# Altium schematic sheet DMB.SchDoc
size B
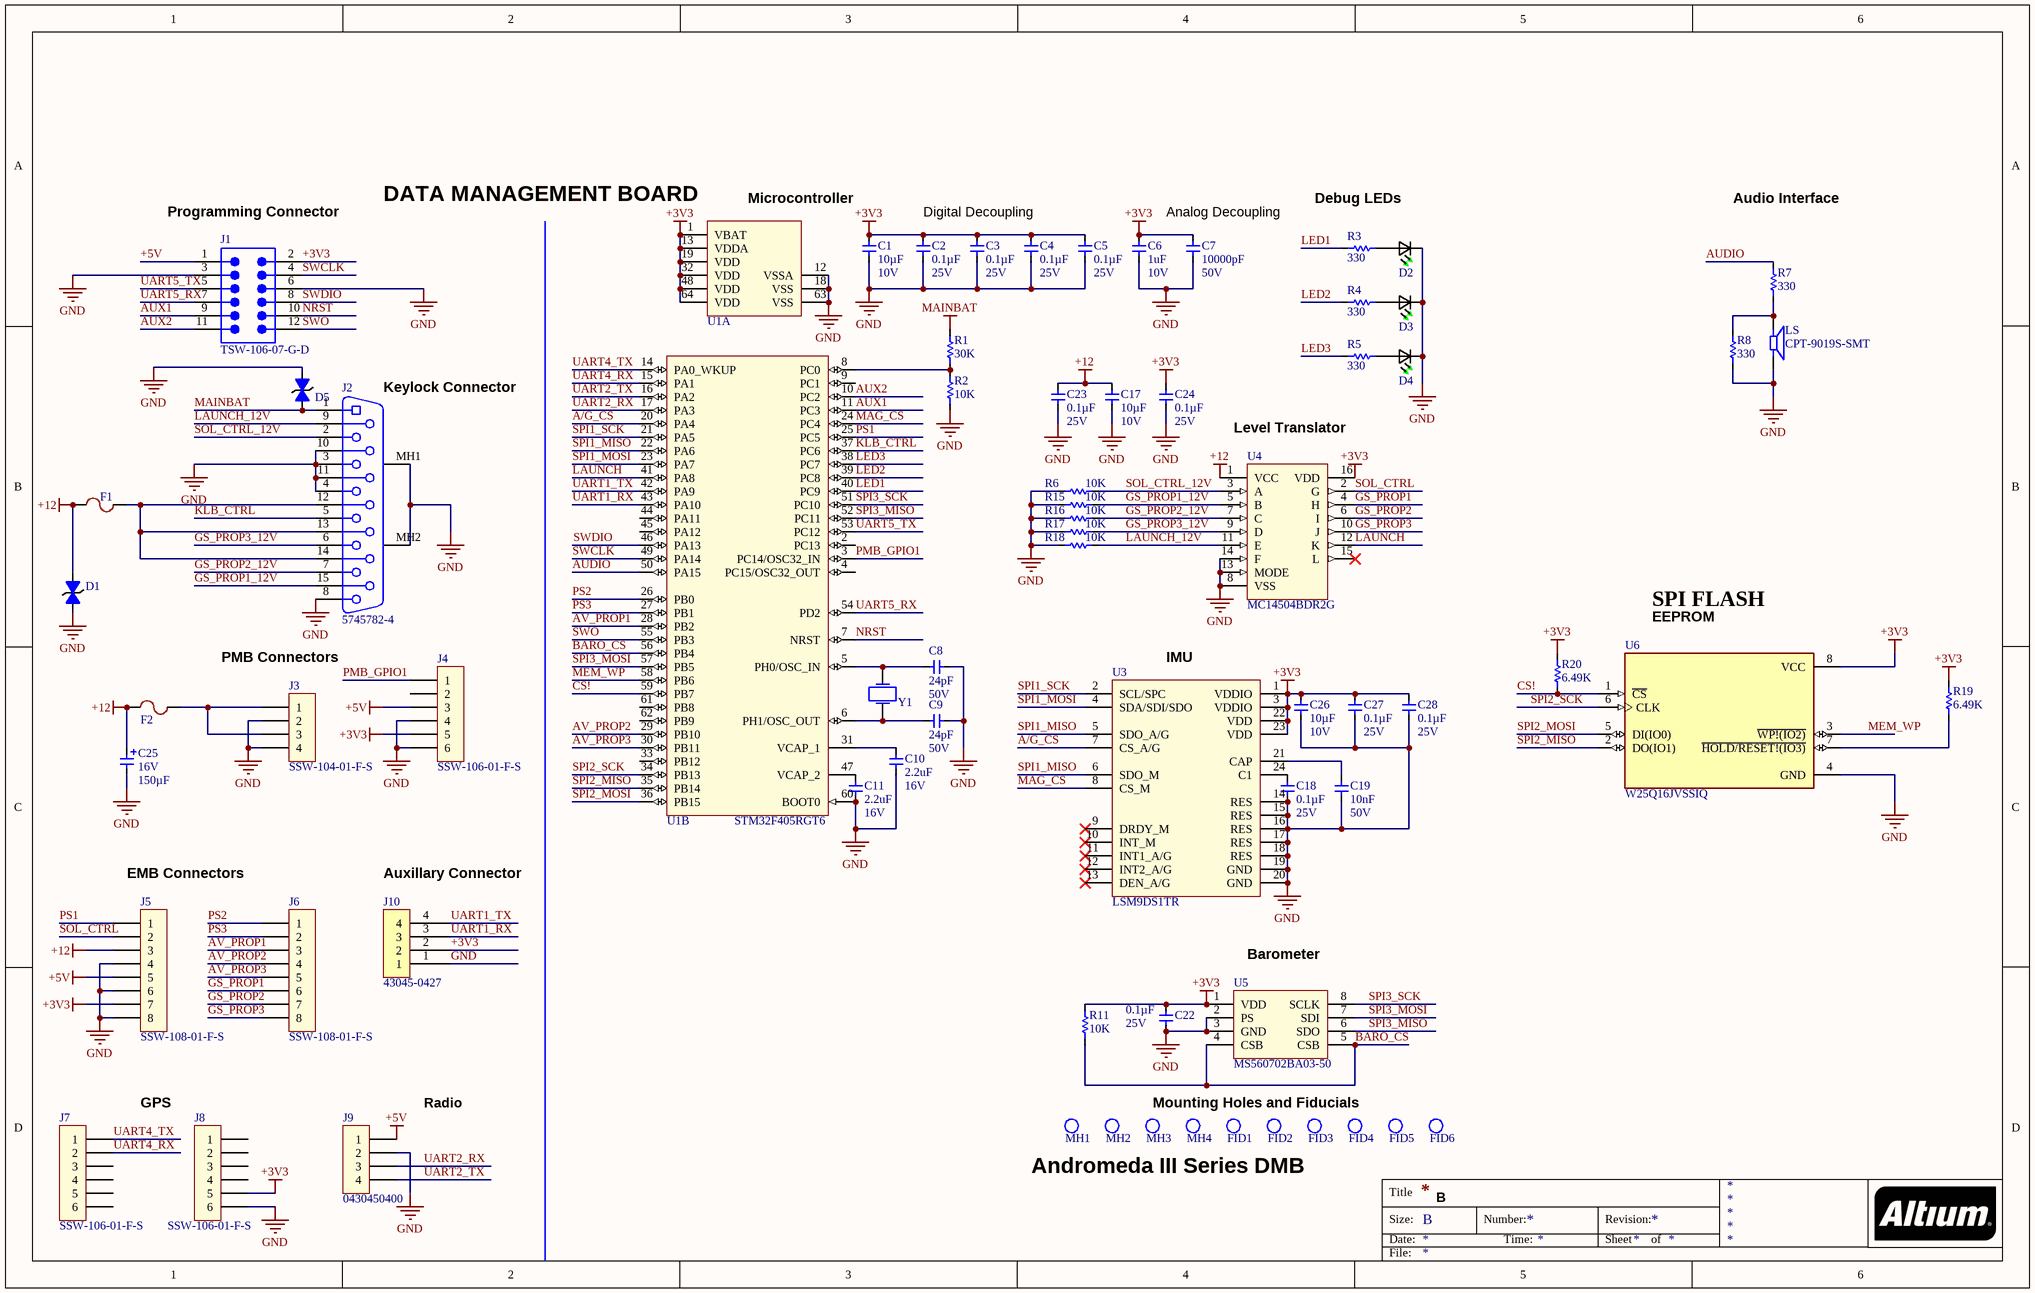
[diagram p0: DMB.SchDoc]

## Parts
C1  Capacitance: 10µF  Voltage - Rated: 10V  [0603[1608]]  (hidden comment: CL10A106MP8NNNC)
C2  Capacitance: 0.1µF  Voltage - Rated: 25V  [0603[1608]]  (hidden comment: CGA3E2X7R1E104K080AA)
C3  Capacitance: 0.1µF  Voltage - Rated: 25V  [0603[1608]]  (hidden comment: CGA3E2X7R1E104K080AA)
C4  Capacitance: 0.1µF  Voltage - Rated: 25V  [0603[1608]]  (hidden comment: CGA3E2X7R1E104K080AA)
C5  Capacitance: 0.1µF  Voltage - Rated: 25V  [0603[1608]]  (hidden comment: CGA3E2X7R1E104K080AA)
C6  Capacitance: 1uF  Voltage - Rated: 10V  [0603[1608]]  (hidden comment: CL10A105KP8NNNC)
C7  Capacitance: 10000pF  Voltage - Rated: 50V  [0603[1608]]  (hidden comment: CGA3E2X7R1H103K080AA)
C8  Capacitance: 24pF  Voltage - Rated: 50V  [0603[1608]]  (hidden comment: 06035A240JAT2A)
C9  Capacitance: 24pF  Voltage - Rated: 50V  [0603[1608]]  (hidden comment: 06035A240JAT2A)
C10  Capacitance: 2.2uF  Voltage - Rated: 16V  [0603[1608]]  (hidden comment: C1608X5R1C225K080AB)
C11  Capacitance: 2.2uF  Voltage - Rated: 16V  [0603[1608]]  (hidden comment: C1608X5R1C225K080AB)
C17  Capacitance: 10µF  Voltage - Rated: 10V  [0603[1608]]  (hidden comment: CL10A106MP8NNNC)
C18  Capacitance: 0.1µF  Voltage - Rated: 25V  [0603[1608]]  (hidden comment: CGA3E2X7R1E104K080AA)
C19  Capacitance: 10nF  Voltage - Rated: 50V  [0603[1608]]  (hidden comment: GRM1885C1H103JA01D)
C22  Capacitance: 0.1µF  Voltage - Rated: 25V  [0603[1608]]  (hidden comment: CGA3E2X7R1E104K080AA)
C23  Capacitance: 0.1µF  Voltage - Rated: 25V  [0603[1608]]  (hidden comment: CGA3E2X7R1E104K080AA)
C24  Capacitance: 0.1µF  Voltage - Rated: 25V  [0603[1608]]  (hidden comment: CGA3E2X7R1E104K080AA)
C25  Voltage - Rated: 16V  Capacitance: 150µF  [TAJD157K016RNJ]  (hidden comment: TAJD157K016RNJ)
C26  Capacitance: 10µF  Voltage - Rated: 10V  [0603[1608]]  (hidden comment: CL10A106MP8NNNC)
C27  Capacitance: 0.1µF  Voltage - Rated: 25V  [0603[1608]]  (hidden comment: CGA3E2X7R1E104K080AA)
C28  Capacitance: 0.1µF  Voltage - Rated: 25V  [0603[1608]]  (hidden comment: CGA3E2X7R1E104K080AA)
D1  CDSOD323-T12C  [CDSOD323-T12C]  (value not drawn)
D2  LTST-C191KGKT  [LTST-C191KGKT]  (value not drawn)
D3  LTST-C191KGKT  [LTST-C191KGKT]  (value not drawn)
D4  LTST-C191KGKT  [LTST-C191KGKT]  (value not drawn)
D5  CDSOD323-T12C  [CDSOD323-T12C]  (value not drawn)
F1  SF-0603FP500M-2  [SF-0603FP500M-2]  (value not drawn)
F2  SF-0603FP500M-2  [SF-0603FP500M-2]  (value not drawn)
FID1  FID_1MM_ROUND_SL  [FID_1MM_ROUND_SL]  (value not drawn)  (no BOM)
FID2  FID_1MM_ROUND_SL  [FID_1MM_ROUND_SL]  (value not drawn)  (no BOM)
FID3  FID_1MM_ROUND_SL  [FID_1MM_ROUND_SL]  (value not drawn)  (no BOM)
FID4  FID_1MM_ROUND_SL  [FID_1MM_ROUND_SL]  (value not drawn)  (no BOM)
FID5  FID_1MM_ROUND_SL  [FID_1MM_ROUND_SL]  (value not drawn)  (no BOM)
FID6  FID_1MM_ROUND_SL  [FID_1MM_ROUND_SL]  (value not drawn)  (no BOM)
J1  TSW-106-07-G-D  [SMTC-TSW-106-07-X-D]
J2  5745782-4  [TECO-5745782-4_V]
J3  SSW-104-01-F-S  [SSW-104-01-F-S]
J4  SSW-106-01-F-S  [SSW-106-01-F-S]
J5  SSW-108-01-F-S  [SSW-108-01-F-S]
J6  SSW-108-01-F-S  [SSW-108-01-F-S]
J7  SSW-106-01-F-S  [SSW-106-01-F-S]
J8  SSW-106-01-F-S  [SSW-106-01-F-S]
J9  0430450400  [0430450400]
J10  43045-0427  [43045-0427]
LS  CPT-9019S-SMT  [CUI_CPT-9019S-SMT]
MH1  Mounting Hole  [MOUNT-HOLE]  (value not drawn)  (no BOM)
MH2  Mounting Hole  [MOUNT-HOLE]  (value not drawn)  (no BOM)
MH3  Mounting Hole  [MOUNT-HOLE]  (value not drawn)  (no BOM)
MH4  Mounting Hole  [MOUNT-HOLE]  (value not drawn)  (no BOM)
R1  Resistance: 30K  [0603[1608]]  (hidden comment: RC0603FR-0730KL)
R2  Resistance: 10K  [0603[1608]]  (hidden comment: ERJ-3GEYJ103V)
R3  Resistance: 330  [0603[1608]]  (hidden comment: RC1608F331CS)
R4  Resistance: 330  [0603[1608]]  (hidden comment: RC1608F331CS)
R5  Resistance: 330  [0603[1608]]  (hidden comment: RC1608F331CS)
R6  Resistance: 10K  [0603[1608]]  (hidden comment: ERJ-3GEYJ103V)
R7  Resistance: 330  [0603[1608]]  (hidden comment: RC1608F331CS)
R8  Resistance: 330  [0603[1608]]  (hidden comment: RC1608F331CS)
R11  Resistance: 10K  [0603[1608]]  (hidden comment: ERJ-3GEYJ103V)
R15  Resistance: 10K  [0603[1608]]  (hidden comment: ERJ-3GEYJ103V)
R16  Resistance: 10K  [0603[1608]]  (hidden comment: ERJ-3GEYJ103V)
R17  Resistance: 10K  [0603[1608]]  (hidden comment: ERJ-3GEYJ103V)
R18  Resistance: 10K  [0603[1608]]  (hidden comment: ERJ-3GEYJ103V)
R19  Resistance: 6.49K  [0603[1608]]  (hidden comment: RT0603DRE076K49L)
R20  Resistance: 6.49K  [0603[1608]]  (hidden comment: RT0603DRE076K49L)
U1  STM32F405RGT6  [TSQFP50P1200X1200X160-64N]  (value not drawn)  (parts A,B of 2)
U3  LSM9DS1TR  [LSM9DS1TR]
U4  MC14504BDR2G  [MC14504BDR2G]
U5  MS560702BA03-50  [MS560702BA03-50]
U6  W25Q16JVSSIQ  [W25Q16JVSSIQ]
Y1  ABLS-8.000MHZ-B2-T  [ABLS-8.000MHZ-B2-T]  (value not drawn)

## Nets
+3V3: C1.2 C2.2 C3.2 C4.2 C5.2 C6.2 C7.2 C22.2 C24.2 C26.2 C27.2 C28.2 J1.2 J4.5 J5.7 J8.5 J10.2 R11.2 R19.2 R20.2 U1.1(VBAT) U1.13(VDDA) U1.19(VDD) U1.32(VDD) U1.48(VDD) U1.64(VDD) U3.1(VDDIO) U3.3(VDDIO) U3.22(VDD) U3.23(VDD) U4.16(VDD) U5.1(VDD) U6.8(VCC)
+5V: J1.1 J4.3 J5.5 J9.1
+12: C17.2 C23.2 C25.1 D1.1 F1.1 F2.1 J5.3 U4.1(VCC)
GND: C1.1 C2.1 C3.1 C4.1 C5.1 C6.1 C7.1 C8.2 C9.2 C10.1 C11.1 C17.1 C18.1 C19.1 C22.1 C23.1 C24.1 C25.2 C26.1 C27.1 C28.1 D1.2 D2.1(K2) D3.1(K2) D4.1(K2) D5.2 J1.3 J1.6 J2.3 J2.4 J2.8 J2.10 J2.11 J2.MH1 J2.MH2 J3.2 J3.4 J4.4 J4.6 J5.4 J5.6 J5.8 J8.6 J9.2 J10.1 LS.2 R2.1 R6.1 R8.2 R15.1 R16.1 R17.1 R18.1 U1.12(VSSA) U1.18(VSS) U1.60(BOOT0) U1.63(VSS) U3.14(RES) U3.15(RES) U3.16(RES) U3.17(RES) U3.18(RES) U3.19(GND) U3.20(GND) U4.8(VSS) U4.13(MODE) U4.14(F) U5.2(PS) U5.3(GND) U6.4(GND)
MAINBAT: D5.1 J2.1 R1.2
A/G_~{CS}: U1.20(PA4) U3.7(CS_A/G)
AUDIO: R7.1 U1.50(PA15)
AUX1: J1.9 U1.11(PC3)
AUX2: J1.11 U1.10(PC2)
AV_PROP1: J6.3 U1.28(PB2)
AV_PROP2: J6.4 U1.29(PB10)
AV_PROP3: J6.5 U1.30(PB11)
BARO_~{CS}: R11.1 U1.56(PB4) U5.4(CSB) U5.5(CSB)
CS!: R20.1 U1.59(PB7) U6.1(~{CS})
GS_PROP1: J6.6 U4.4(H)
GS_PROP1_12V: J2.15 R15.2 U4.5(B)
GS_PROP2: J6.7 U4.6(I)
GS_PROP2_12V: J2.7 R16.2 U4.7(C)
GS_PROP3: J6.8 U4.10(J)
GS_PROP3_12V: J2.6 R17.2 U4.9(D)
KLB_CTRL: J2.5 U1.37(PC6)
LAUNCH: U1.41(PA8) U4.12(K)
LAUNCH_12V: J2.9 R18.2 U4.11(E)
LED1: R3.2 U1.40(PC9)
LED2: R4.2 U1.39(PC8)
LED3: R5.2 U1.38(PC7)
MAG_~{CS}: U1.24(PC4) U3.8(CS_M)
MEM_WP: U1.58(PB6) U6.3(~{WP!(IO2)})
NRST: J1.10 U1.7(NRST)
PMB_GPIO1: J4.1 U1.3(PC14/OSC32_IN)
PS1: J5.1 U1.25(PC5)
PS2: J6.1 U1.26(PB0)
PS3: J6.2 U1.27(PB1)
SOL_CTRL: J5.2 U4.2(G)
SOL_CTRL_12V: J2.2 R6.2 U4.3(A)
SPI1_MISO: U1.22(PA6) U3.5(SDO_A/G) U3.6(SDO_M)
SPI1_MOSI: U1.23(PA7) U3.4(SDA/SDI/SDO)
SPI1_SCK: U1.21(PA5) U3.2(SCL/SPC)
SPI2_MISO: U1.35(PB14) U6.2(DO(IO1))
SPI2_MOSI: U1.36(PB15) U6.5(DI(IO0))
SPI2_SCK: U1.34(PB13) U6.6(CLK)
SPI3_MISO: U1.52(PC11) U5.6(SDO)
SPI3_MOSI: U1.57(PB5) U5.7(SDI)
SPI3_SCK: U1.51(PC10) U5.8(SCLK)
SWCLK: J1.4 U1.49(PA14)
SWDIO: J1.8 U1.46(PA13)
SWO: J1.12 U1.55(PB3)
UART1_RX: J10.3 U1.43(PA10)
UART1_TX: J10.4 U1.42(PA9)
UART2_RX: J9.3 U1.17(PA3)
UART2_TX: J9.4 U1.16(PA2)
UART4_RX: J7.2 U1.15(PA1)
UART4_TX: J7.1 U1.14(PA0_WKUP)
UART5_RX: J1.7 U1.54(PD2)
UART5_TX: J1.5 U1.53(PC12)
NetC8_1: C8.1 U1.5(PH0/OSC_IN) Y1.2
NetC9_1: C9.1 U1.6(PH1/OSC_OUT) Y1.1
NetC10_2: C10.2 U1.31(VCAP_1)
NetC11_2: C11.2 U1.47(VCAP_2)
NetC18_2: C18.2 U3.24(C1)
NetC19_2: C19.2 U3.21(CAP)
NetD2_2: D2.2(A2) R3.1
NetD3_2: D3.2(A2) R4.1
NetD4_2: D4.2(A2) R5.1
NetF1_2: F1.2 J2.12 J2.13 J2.14
NetF2_2: F2.2 J3.1 J3.3
NetLS_1: LS.1 R7.2 R8.1
NetR1_1: R1.1 R2.2 U1.8(PC0)
NetR19_1: R19.1 U6.7(~{HOLD/RESET!(IO3)})

Not connected (* = marked no-connect by the designer): J4 2; J7 3 4 5 6; J8 1 2 3 4; U1 2(PC13) 4(PC15/OSC32_OUT) 9(PC1) 33(PB12) 44(PA11) 45(PA12) 61(PB8) 62(PB9); U3 9(DRDY_M)* 10(INT_M)* 11(INT1_A/G)* 12(INT2_A/G)* 13(DEN_A/G)*; U4 15(L)*

## Notes on the sheet
- (near J1) Programming Connector
- DATA MANAGEMENT BOARD
- Microcontroller
- Digital Decoupling
- Analog Decoupling
- Debug LEDs
- Audio Interface
- (near J2) Keylock Connector
- Level Translator
- (near U6) EEPROM
- SPI FLASH
- PMB Connectors
- (near U3) IMU
- (near J5) EMB Connectors
- (near J10) Auxillary Connector
- Barometer
- GPS
- Radio
- Mounting Holes and Fiducials
- Andromeda III Series DMB
- B
- Title
- Size:
- Date:
- Number:
- Time:
- Revision:
- Sheet
- of
- File:

## Library data of the parts
C1 C17 C26 = CL10A106MP8NNNC: CAP CER 10UF 10V X5R 0603; Manufacturer: Samsung Electro-Mechanics; Tolerance: ±20%; Temperature Coefficient: X5R; Operating Temperature: -55°C ~ 85°C; Mounting Type: Surface Mount, MLCC; Package / Case: 0603 (1608 Metric); Size / Dimension: 0.063" L x 0.031" W (1.60mm x 0.80mm); Manufacturer Part Number: CL10A106MP8NNNC; Thickness (Max): 0.035" (0.90mm); ComponentLink1Description: Datasheet; ComponentLink1URL: https://static6.arrow.com/aropdfconversion/f91a1722e2705c3d73cfb1979021b64ae4055093/19-cl10a106mp8nnnc.pdf; Supplier 1: Digi-Key; Supplier Part Number 1: 1276-1871-1-ND
C2-C5 C18 C22-C24 C27 C28 = CGA3E2X7R1E104K080AA: CAP CER 0.1UF 25V X7R 0603; Manufacturer: TDK Corporation; Tolerance: ±10%; Temperature Coefficient: X7R; Operating Temperature: -55°C ~ 125°C; Mounting Type: Surface Mount, MLCC; Package / Case: 0603 (1608 Metric); Size / Dimension: 0.063" L x 0.031" W (1.60mm x 0.80mm); Manufacturer Part Number: CGA3E2X7R1E104K080AA; Thickness (Max): 0.035" (0.90mm); ComponentLink1Description: Datasheet; ComponentLink1URL: https://product.tdk.com/info/en/catalog/spec/mlccspec_automotive_general_en.pdf; Supplier 1: Digi-Key; Supplier Part Number 1: 445-5667-1-ND
C6 = CL10A105KP8NNNC: CAP CER 1UF 10V X5R 0603; Manufacturer: Samsung Electro-Mechanics; Tolerance: ±10%; Temperature Coefficient: X5R; Operating Temperature: -55°C ~ 85°C; Mounting Type: Surface Mount, MLCC; Package / Case: 0603 (1608 Metric); Size / Dimension: 0.063" L x 0.031" W (1.60mm x 0.80mm); Manufacturer Part Number: CL10A105KP8NNNC; Thickness (Max): 0.035" (0.90mm); ComponentLink1Description: Datasheet; ComponentLink1URL: http://www.samsungsem.com/kr/support/product-search/mlcc/__icsFiles/afieldfile/2019/05/10/19-CL10A105KP8NNNC.pdf; Supplier 1: Digi-Key; Supplier Part Number 1: 1276-1182-1-ND
C7 = CGA3E2X7R1H103K080AA: CAP CER 10000PF 50V X7R 0603; Manufacturer: TDK Corporation; Tolerance: ±10%; Temperature Coefficient: X7R; Operating Temperature: -55°C ~ 125°C; Mounting Type: Surface Mount, MLCC; Package / Case: 0603 (1608 Metric); Size / Dimension: 0.063" L x 0.031" W (1.60mm x 0.80mm); Manufacturer Part Number: CGA3E2X7R1H103K080AA; Thickness (Max): 0.035" (0.90mm); ComponentLink1Description: Datasheet; ComponentLink1URL: https://product.tdk.com/info/en/catalog/spec/mlccspec_automotive_general_en.pdf; Supplier 1: Digi-Key; Supplier Part Number 1: 445-5662-1-ND
C8 C9 = 06035A240JAT2A: CAP CER 24PF 50V NP0 0603; Manufacturer: AVX Corporation; Tolerance: ±5%; Temperature Coefficient: C0G, NP0; Operating Temperature: -55°C ~ 125°C; Mounting Type: Surface Mount, MLCC; Package / Case: 0603 (1608 Metric); Size / Dimension: 0.063" L x 0.032" W (1.60mm x 0.81mm); Manufacturer Part Number: 06035A240JAT2A; Thickness (Max): 0.035" (0.90mm); ComponentLink1Description: Datasheet; ComponentLink1URL: http://datasheets.avx.com/C0GNP0-Dielectric.pdf; Supplier 1: Digi-Key; Supplier Part Number 1: 478-10304-1-ND
C10 C11 = C1608X5R1C225K080AB: CAP CER 2.2UF 16V X5R 0603; Manufacturer: TDK Corporation; Tolerance: ±10%; Temperature Coefficient: X5R; Operating Temperature: -55°C ~ 85°C; Mounting Type: Surface Mount, MLCC; Package / Case: 0603 (1608 Metric); Size / Dimension: 0.063" L x 0.031" W (1.60mm x 0.80mm); Manufacturer Part Number: C1608X5R1C225K080AB; Thickness (Max): 0.035" (0.90mm); ComponentLink1Description: Datasheet; ComponentLink1URL: https://product.tdk.com/info/en/catalog/spec/mlccspec_commercial_general_midvoltage_en.pdf; Supplier 1: Digi-Key; Supplier Part Number 1: 445-5157-1-ND
C19 = GRM1885C1H103JA01D: CAP CER 10000PF 50V C0G/NP0 0603; Manufacturer: Murata Electronics; Tolerance: ±50%; Temperature Coefficient: C0G, NP0; Operating Temperature: -55°C ~ 125°C; Mounting Type: Surface Mount, MLCC; Package / Case: 0603 (1608 Metric); Size / Dimension: 0.063" L x 0.031" W (1.60mm x 0.80mm); Manufacturer Part Number: GRM1885C1H103JA01D; Thickness (Max): 0.035" (0.90mm); ComponentLink1Description: Datasheet; ComponentLink1URL: https://www.murata.com/~/media/webrenewal/support/library/catalog/products/capacitor/mlcc/c02e.ashx?la=en-us; Supplier 1: Digi-Key; Supplier Part Number 1: 490-9666-1-ND
C25 = TAJD157K016RNJ: CAP TANT 150UF 10% 16V 2917; Manufacturer: AVX Corporation; Manufacturer Size Code: D; Type: Molded; ESR: 900mOhm; Tolerance: ±10%; Operating Temperature: -55°C ~ 125°C; Mounting Type: Surface Mount; Package / Case: 2917 (7343 Metric); Manufacturer Part Number: TAJD157K016RNJ; Size / Dimension: 0.287" L x 0.169" W (7.30mm x 4.30mm); Height - Seated (Max): 0.122" (3.10mm); ComponentLink1Description: Datasheet; ComponentLink1URL: http://datasheets.avx.com/TAJ.pdf; Supplier 1: Digi-Key; Supplier Part Number 1: 478-2356-1-ND
D1 D5 = CDSOD323-T12C: TVS DIODE 12V 28.3V SOD323; Manufacturer: Bourns Inc.; Type: Zener; Bidirectional Channels: 1; Voltage - Breakdown (Min): 13.3V; Voltage - Clamping (Max) @ Ipp: 28.3V (Typ); Current - Peak Pulse (10/1000µs): 11A (8/20µs); Power - Peak Pulse: 350W; Power Line Protection: No; Capacitance @ Frequency: 3pF @ 1MHz; ComponentLink1Description: Datasheet; ComponentLink1URL: https://www.bourns.com/docs/Product-Datasheets/CDSOD323-TxxC.PDF; Manufacturer Part Number: CDSOD323-T12C; Voltage - Reverse Standoff (Typ): 12V; Operating Temperature: -55°C ~ 150°C (TJ); Mounting Type: Surface Mount; Package / Case: SC-76, SOD-323; Supplier 1: Digi-Key; Supplier Part Number 1: CDSOD323-T12CCT-ND
D2-D4 = LTST-C191KGKT: LED GREEN CLEAR SMD 0603; Manufacturer: Lite-On Inc.; Lens Color: Colourless; Millicandela Rating: 35mcd; Lens Style: Rectangle with Flat Top; Lens Size: 1.10mm x 0.80mm; Voltage - Forward (Vf) (Typ): 2V; Current - Test: 20mA; Viewing Angle: 130°; Wavelength - Dominant: 571nm; Wavelength - Peak: 574nm; ComponentLink1Description: Datasheet; ComponentLink1URL: http://optoelectronics.liteon.com/upload/download/DS22-2000-228/LTST-C191KGKT.PDF; Manufacturer Part Number: LTST-C191KGKT; Colour: Green; Lens Transparency: Clear; Mounting Type: Surface Mount; Package / Case: 0603 (1608 Metric); Size / Dimension: 1.60mm L x 0.80mm W; Height (Max): 0.65mm; Supplier 1: Digi-Key; Supplier Part Number 1: 160-1446-1-ND
F1 F2 = SF-0603FP500M-2: FUSE BOARD MOUNT 5A 32VDC 0603; Manufacturer: Bourns Inc.; Response Time: Fast Blow; Breaking Capacity @ Rated Voltage: 35A; Melting I²t: 2.62; Approval Agency: UL; DC Cold Resistance: 0.015 Ohms; Fuse Type: Board Mount (Cartridge Style Excluded); Voltage Rating - DC: 32V; ComponentLink1Description: Datasheet; ComponentLink1URL: https://www.bourns.com/docs/Product-Datasheets/SF-0603FPxxxM.pdf; Manufacturer Part Number: SF-0603FP500M-2; Mounting Type: Surface Mount; Package / Case: 0603 (1608 Metric); Operating Temperature: -55°C ~ 150°C; Size / Dimension: 0.063" L x 0.031" W x 0.012" H (1.60mm x 0.80mm x 0.18mm); Current Rating (Amps): 5A; Supplier 1: Digi-Key; Supplier Part Number 1: SF-0603FP500M-2CT-ND
FID1-FID6 = FID_1MM_ROUND_SL: Fiducial 1mm Round Single Layer
J1 = CMP-1024-00379-1: 0.025" SQ Post Header, Through-hole, Vertical, -55 to 125 degC, 2.54 mm Pitch, 12-Pin, Male, RoHS; Manufacturer: Samtec; Pitch: 2.54 mm; ComponentLink1URL: http://www.samtec.com; DatasheetVersion: F-214; ComponentLink3URL: http://www.samtec.com/documents/webfiles/cpdf/TSW-XXX-XX-XXX-X-XX-XXX-MKT.pdf; PackageVersion: DM, 8/1988; Mounting Technology: Through-hole; ComponentLink1Description: Manufacturer URL; Orientation: Vertical; PackageDescription: .025[0.64] SQ. Post Terminal Strip Assembly; ComponentLink2URL: http://www.samtec.com/documents/webfiles/pdf/TSW_TH.PDF; RoHS: True; ComponentLink3Description: Package Specification; ComponentLink2Description: Datasheet; PackageReference: TSW-106-07-X-D; Temperature Range: -55 to 125 degC; PartNumber: TSW-106-07-G-D
J2 = CMP-2000-05646-1: Female D-Sub Connector, Pitch 2.74 mm, 2 Row, 15 Position, Height 12.93 mm, Tail Length 3.18 mm, -55 to 105 degC, RoHS, Tray; Manufacturer: TE Connectivity; Voltage Rating: 125V; Featured Product: AMPLIMITED-SubminiatureConnectors; Flange Feature: Housing/Shell(4-40); Current Rating: 6A; Number of Positions: 15; Catalog Drawings: AMPD-SubMale.318; Mating Products: 1-745494-8-ND / -CONNPLUG15POS26-22AWGGOLD/FL / A34118-ND / -CONND-SUBPLUG15P22-26AWGAU / A32503-ND / -CONNDSUBPLUG15POSSLDCUP / AMR15B-ND / -CONND-SUBPLUG15POSGOLD / AML15B-ND / -CONND-SUBPLUG15POSGOLD / A31968-ND / -CONND-SUBPLUG15P22-26AWGAU / A31967-ND / -CONND-SUBPLUG15P26-30AWGAU; Connector Type: Receptacle,FemaleSockets; Dynamic Catalog: AMPLIMITEHD-20Series; 3D Model: 5745782-4.pdf; Other Names: A32076; Product Training Modules: AMPLIMITED-SubConnectors; Features: GroundStrap; Termination: Solder; Mounting Type: ThroughHole,RightAngle; Contact Finish Thickness: 30µin(0.76µm); Shell Material, Finish: Steel,TinPlated; Category: Connectors,Interconnects; Shell Size, Connector Layout: 2(DA,A); Package Description: Female D-Sub Connector, Pitch 2.74 mm, 2 Row, 15 Position, Height 12.93 mm, Tail Length 3.18 mm; Color: Black; Family: D-SubConnectors; Series: AMPLIMITEHD-20; Contact Finish: Gold; Mounting Technology: ThroughHole; Housing Material: Thermoplastic; Package Reference: 5745782-4; RoHS Information: 5745782-4StatementofCompliance; Standard Package: 104; Datasheet Version: Rev. R, 08/2011; Manufacturer URL: http://www.te.com/; Number of Rows: 2; Operating Temperature: -55°C~105°C; Connector Style: D-Sub; Datasheet URL: http://www.te.com/commerce/DocumentDelivery/DDEController?Action=srchrtrv&DocNm=5745782&DocType=Customer+Drawing&DocLang=English; Contact Type: Signal
J3 = SSW-104-01-F-S: CONN RCPT 4POS FEMALE 0.1 GOLD PCB; Manufacturer: Samtec Inc.; Connector Type: Receptacle; Style: Board to Board or Cable; Number of Positions: 4; Pitch - Mating: 0.100" (2.54mm); Contact Length - Post: 0.104" (2.64mm); Material Flammability Rating: UL94 V-0; Current Rating (Amps): 5.7A per Contact; ComponentLink1Description: Drawing; ComponentLink1URL: http://suddendocs.samtec.com/prints/ssw-1xx-xx-xxx-x-xx-xxx-xx-mkt.pdf; ComponentLink2Description: Datasheet; ComponentLink2URL: http://suddendocs.samtec.com/catalog_english/ssw_th.pdf; Manufacturer Part Number: SSW-104-01-F-S; Contact Type: Forked; Number of Rows: 1; Mounting Type: Through Hole; Termination: Solder; Fastening Type: Push-Pull; Contact Finish - Mating: Gold; Contact Finish Thickness - Mating: 3.00µin (0.076µm); Insulation Color: Black; Insulation Height: 0.335" (8.51mm); Operating Temperature: -55°C ~ 125°C; Contact Finish - Post: Tin; Insulation Material: Liquid Crystal Polymer (LCP); Contact Shape: Square; Contact Material: Phosphor Bronze; Supplier 1: Digi-Key; Supplier Part Number 1: SAM10018-ND
J4 J7 J8 = SSW-106-01-F-S: CONN RCPT 6POS FEMALE 0.1 GOLD PCB; Manufacturer: Samtec Inc.; Connector Type: Receptacle; Style: Board to Board or Cable; Number of Positions: 6; Pitch - Mating: 0.100" (2.54mm); Contact Length - Post: 0.104" (2.64mm); Material Flammability Rating: UL94 V-0; Current Rating (Amps): 5.7A per Contact; ComponentLink1Description: Drawing; ComponentLink1URL: http://suddendocs.samtec.com/prints/ssw-1xx-xx-xxx-x-xx-xxx-xx-mkt.pdf; ComponentLink2Description: Datasheet; ComponentLink2URL: http://suddendocs.samtec.com/catalog_english/ssw_th.pdf; Manufacturer Part Number: SSW-106-01-F-S; Contact Type: Forked; Number of Rows: 1; Mounting Type: Through Hole; Termination: Solder; Fastening Type: Push-Pull; Contact Finish - Mating: Gold; Contact Finish Thickness - Mating: 3.00µin (0.076µm); Insulation Color: Black; Insulation Height: 0.335" (8.51mm); Operating Temperature: -55°C ~ 125°C; Contact Finish - Post: Tin; Insulation Material: Liquid Crystal Polymer (LCP); Contact Shape: Square; Contact Material: Phosphor Bronze; Supplier 1: Digi-Key; Supplier Part Number 1: SAM10025-ND
J5 J6 = SSW-108-01-F-S: CONN RCPT 8POS FEMALE 0.1 GOLD PCB; Manufacturer: Samtec Inc.; Connector Type: Receptacle; Style: Board to Board or Cable; Number of Positions: 8; Pitch - Mating: 0.100" (2.54mm); Contact Length - Post: 0.104" (2.64mm); Material Flammability Rating: UL94 V-0; Current Rating (Amps): 5.7A per Contact; ComponentLink1Description: Drawing; ComponentLink1URL: http://suddendocs.samtec.com/prints/ssw-1xx-xx-xxx-x-xx-xxx-xx-mkt.pdf; ComponentLink2Description: Datasheet; ComponentLink2URL: http://suddendocs.samtec.com/catalog_english/ssw_th.pdf; Manufacturer Part Number: SSW-108-01-F-S; Contact Type: Forked; Number of Rows: 1; Mounting Type: Through Hole; Termination: Solder; Fastening Type: Push-Pull; Contact Finish - Mating: Gold; Contact Finish Thickness - Mating: 3.00µin (0.076µm); Insulation Color: Black; Insulation Height: 0.335" (8.51mm); Operating Temperature: -55°C ~ 125°C; Contact Finish - Post: Tin; Insulation Material: Liquid Crystal Polymer (LCP); Contact Shape: Square; Contact Material: Phosphor Bronze; Supplier 1: Digi-Key; Supplier Part Number 1: SAM11943-ND
J9 = 0430450400: CONN HEADER R/A 4POS 3MM; Manufacturer: Molex; Number of Positions: 4; Row Spacing - Mating: 0.118" (3.00mm); Shrouding: Shrouded - 4 Wall; Contact Length - Post: 0.125" (3.18mm); Material Flammability Rating: UL94 V-0; Current Rating (Amps): 8A; Voltage Rating: 600V; ComponentLink1Description: Datasheet; ComponentLink1URL: https://www.molex.com/pdm_docs/sd/430450400_sd.pdf; ComponentLink2Description: Product Specification; ComponentLink2URL: https://www.molex.com/pdm_docs/ps/PS-43045.pdf; Manufacturer Part Number: 0430450400; Contact Type: 0.118" (3.00mm); Number of Rows: 2; Mounting Type: Through Hole, Right Angle; Termination: Solder; Fastening Type: Locking Ramp; Insulation Height: 0.290" (7.37mm); Contact Shape: Square; Contact Finish - Mating: Tin; Contact Finish Thickness - Mating: 100.0µin (2.54µm); Contact Finish - Post: Tin; Contact Material: Brass; Insulation Material: Liquid Crystal Polymer (LCP), Glass Filled; Features: Board Lock; Insulation Color: Black; Supplier 1: Digi-Key; Supplier Part Number 1: WM1814-ND
J10 = 43045-0427: Checked Conn Header 4 POS 3mm Solder ST Thru-Hole 4 Terminal 1 Port Micro-Fit 3.0 Tray Headers and Wire Housings 0.735
LS = CPT-9019S-SMT: 9 mm, 25 Vp-p Vdc, 65 dB, Surface Mount _SMT_, Piezo Audio Transducer Buzzer; MP: CPT-9019S-SMT-TR; MF: CUI Devices; Price: None; Package: SIP-1; Value: *; Availability: Unavailable; SnapEDA_Link: https://www.snapeda.com/parts/CPT-9019S-SMT-TR/CUI%20Devices/view-part/563283/?ref=snap
MH1-MH4 = Mounting Hole: #4 Screw, 0.116in Diameter
R1 = RC0603FR-0730KL: RES SMD 30K OHM 1% 1/10W 0603; Manufacturer: Yageo; Power  (W): 0.1W; Temperature Coefficient: ±100ppm/°C; Package: 0603 (1608 Metric); Tolerance: ±1%; Operating Temperature: -55°C ~ 155°C; Composition: Thick Film; Manufacturer Part Number: RC0603FR-0730KL; ComponentLink1Description: Datasheet; ComponentLink1URL: https://www.yageo.com/upload/media/product/productsearch/datasheet/rchip/PYu-RC_Group_51_RoHS_L_10.pdf; Supplier 1: Digi-Key; Supplier Part Number 1: 311-30.0KHRCT-ND
R2 R6 R11 R15-R18 = ERJ-3GEYJ103V: RES SMD 10K OHM 5% 1/10W 0603; Manufacturer: Panasonic Electronic Components; Power  (W): 0.1W; Temperature Coefficient: ±200ppm/°C; Package: 0603 (1608 Metric); Tolerance: ±5%; Operating Temperature: -55°C ~ 155°C; Composition: Thick Film; Manufacturer Part Number: ERJ-3GEYJ103V; ComponentLink1Description: Datasheet; ComponentLink1URL: https://industrial.panasonic.com/cdbs/www-data/pdf/RDA0000/DMA0000COL11.pdf; Supplier 1: Digi-Key; Supplier Part Number 1: P10KGCT-ND; ComponentLink2Description: Land Pattern; ComponentLink2URL: https://industrial.panasonic.com/cdbs/www-data/pdf/RDA0000/DMA0000COL17.pdf
R3-R5 R7 R8 = RC1608F331CS: RES SMD 330 OHM 1% 1/10W 0603; Manufacturer: Samsung Electro-Mechanics; Power  (W): 0.1W; Temperature Coefficient: ±100ppm/°C; Package: 0603 (1608 Metric); Tolerance: ±1%; Operating Temperature: -55°C ~ 155°C; Composition: Thick Film; Manufacturer Part Number: RC1608F331CS; ComponentLink1Description: Datasheet; ComponentLink1URL: http://www.samsungsem.com/kr/support/product-search/chip-resistor/__icsFiles/afieldfile/2019/01/21/RC_Spec_Sheet(1901).pdf; Supplier 1: Digi-Key; Supplier Part Number 1: 1276-4604-2-ND
R19 R20 = RT0603DRE076K49L: RES SMD 6.49KOHM 0.5% 1/10W 0603; Manufacturer: Yageo; Power  (W): 0.1W; Temperature Coefficient: ±500ppm/°C; Package: 0603 (1608 Metric); Tolerance: ±0.5%; Operating Temperature: -55°C ~ 155°C; Composition: Thick Film; Manufacturer Part Number: RT0603DRE076K49L; ComponentLink1Description: Datasheet; ComponentLink1URL: https://4donline.ihs.com/images/VipMasterIC/IC/YAGO/YAGO-S-A0008510989/YAGO-S-A0008510989-1.pdf?hkey=52A5661711E402568146F3353EA87419; Supplier 1: Digi-Key; Supplier Part Number 1: 311-2658-1-ND
U1 = STM32F405RGT6: IC MCU 32BIT 1MB FLASH 64LQFP; Manufacturer: STMicroelectronics; Core Processor: ARM® Cortex®-M4; Core Size: 32-Bit; Speed: 168MHz; Connectivity: CANbus, I²C, IrDA, LINbus, SPI, UART/USART, USB OTG; Peripherals: Brown-out Detect/Reset, DMA, I²S, LCD, POR, PWM, WDT; Number of I/O: 51; Program Memory Size: 1MB (1M x 8); RAM Size: 192K x 8; Voltage - Supply (VDD): 1.8V ~ 3.6V; Data Converters: A/D 16x12b; D/A 2x12b; Oscillator Type: Internal; ComponentLink1Description: Datasheet; ComponentLink1URL: https://www.st.com/content/ccc/resource/technical/document/datasheet/ef/92/76/6d/bb/c2/4f/f7/DM00037051.pdf/files/DM00037051.pdf/jcr:content/translations/en.DM00037051.pdf; Program Memory Type: FLASH; Manufacturer Part Number: STM32F405RGT6; Operating Temperature: -40°C ~ 85°C (TA); Mounting Type: Surface Mount; Package / Case: 64-LQFP; Supplier 1: Digi-Key; Supplier Part Number 1: 497-11767-ND
U3 = LSM9DS1TR: IMU ACCEL/GYRO/MAG I2C/SPI 24LGA; Manufacturer: STMicroelectronics; Sensor Type: Accelerometer, Gyroscope, Magnetometer, Temperature, 9 Axis; Output Type: I²C, SPI; ComponentLink1Description: Datasheet; ComponentLink1URL: https://www.st.com/content/ccc/resource/technical/document/datasheet/1e/3f/2a/d6/25/eb/48/46/DM00103319.pdf/files/DM00103319.pdf/jcr:content/translations/en.DM00103319.pdf; Supplier 1: Digi-Key; Supplier Part Number 1: 497-14946-1-ND; Operating Temperature: -40°C ~ 85°C (TA); Package / Case: 24-TFLGA Module; Supplier Device Package: 24-LGA (3x3.5); Mounting Type: Surface Mount; Manufacturer Part Number: LSM9DS1TR
U4 = MC14504BDR2G: IC TRNSLTR UNIDIRECTIONAL 16SOIC; Manufacturer: ON Semiconductor; Manufacturer Part Number: MC14504BDR2G; ComponentLink1Description: Datasheet; ComponentLink1URL: https://www.onsemi.com/pub/Collateral/MC14504B-D.PDF; Supplier 1: Digi-Key; Supplier Part Number 1: MC14504BDR2GOSCT-ND
U5 = MS560702BA03-50: BAROMETRIC PRESSURE SENSOR; Manufacturer: TE Connectivity Measurement Specialties; Pressure Type: Absolute; Operating Pressure: 0.15PSI ~ 17.4PSI (1kPa ~ 120kPa); Output Type: I²C, SPI; Output: 24 b; Accuracy: ±0.022PSI (±0.15kPa); Voltage - Supply: 1.8V ~ 3.6V; Maximum Pressure: 87.02PSI (600kPa); Digi-Key Part Number: 223-1198-1-ND; Manufacturer Part Number: MS560702BA03-50; Termination Style: SMD (SMT) Tab; Operating Temperature: -40°C ~ 85°C; Package / Case: 8-SMD; ComponentLink1Description: Datasheet; ComponentLink1URL: https://www.te.com/commerce/DocumentDelivery/DDEController?Action=srchrtrv&DocNm=MS5607-02BA03&DocType=Data+Sheet&DocLang=English; Supplier 1: Digi-Key; Supplier Part Number 1: 223-1198-1-ND
U6 = W25Q16JVSSIQ: FLASH - NOR Memory IC 16Mb _2M x 8_ SPI - Quad I/O 133MHz 8-SOIC; MF: Winbond Electronics; Price: None; Package: SOIC-8 Winbond; MP: W25Q16JVSSIQ; Value: *; Availability: Unavailable; SnapEDA_Link: https://www.snapeda.com/parts/W25Q16JVSSIQ/Winbond%20Electronics/view-part/618098/?ref=snap
Y1 = ABLS-8.000MHZ-B2-T: CRYSTAL 8.0000MHZ 18PF SMD; Manufacturer: Abracon LLC; Frequency Stability: ±50ppm; Frequency Tolerance: ±20ppm; ESR (Equivalent Series Resistance): 80 Ohms; Operating Mode: Fundamental; Supplier 1: Digi-Key; Series: ABLS; Packaging: Cut Tape(CT); Type: MHz Crystal; Load Capacitance: 18pF; Operating Temperature: -20°C ~ 70°C; Mounting Type: Surface Mount; Package/Case: HC-49/US; Size / Dimension: 0.449" L x 0.185" W (11.40mm x 4.70mm); Height - Seated (Max): 0.165" (4.20mm); Supplier Part Number 1: 535-9089-1-ND; ComponentLink1Description: Datasheet; ComponentLink1URL: https://abracon.com/Resonators/abls.pdf; ComponentLink2Description: Drawing; ComponentLink2URL: https://abracon.com/Support/PackageDrawing/Resonators/ABLS-2D.pdf